# EAGLE design strobo (EAGLE 7.3.0)
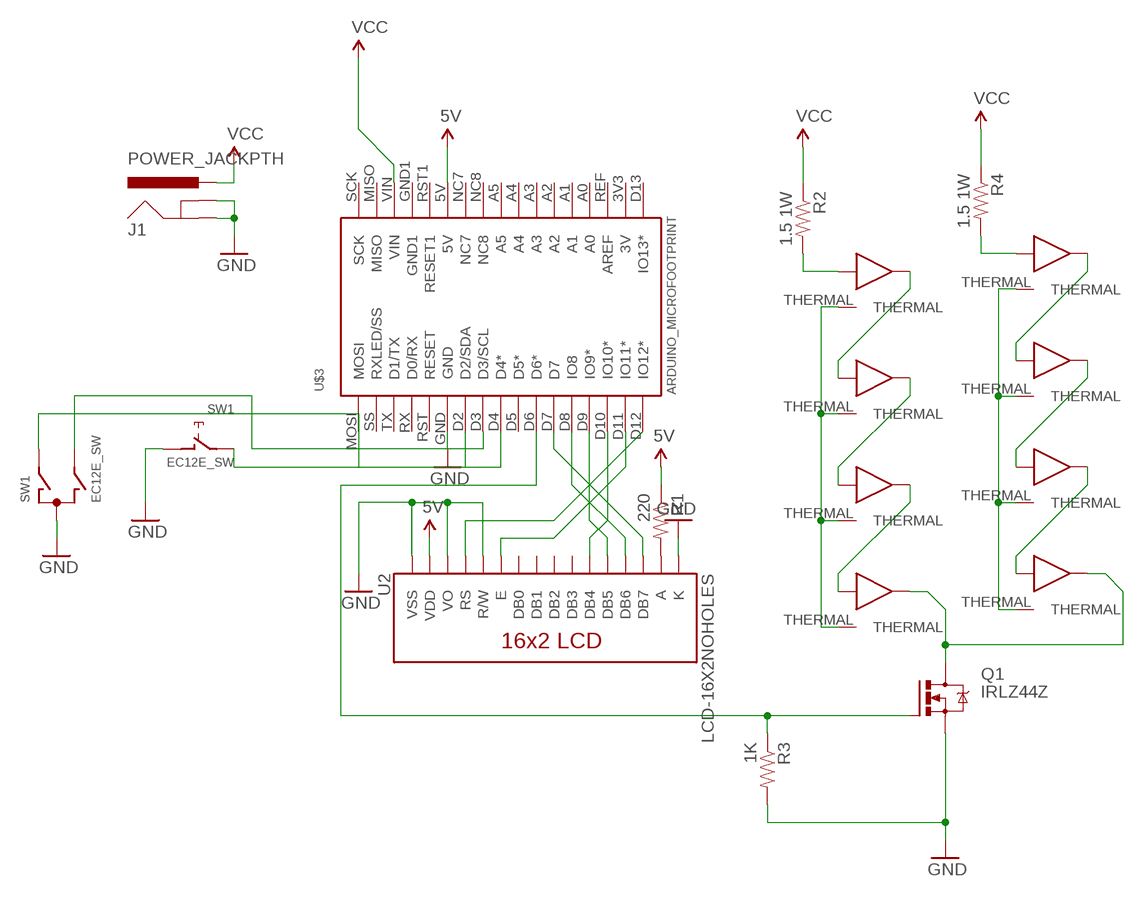
[diagram p0: schematic, sheet 1]

## Parts
J1  POWER_JACKPTH  [POWER_JACK_PTH]
Q1  IRLZ44Z  [TO220BH]
R1  220  RESISTORPTH-1/4W  [AXIAL-0.4]
R2  1.5 1W  RESISTORPTH-1/4W  [AXIAL-0.4]
R3  1K  RESISTORPTH-1/4W  [AXIAL-0.4]
R4  1.5 1W  RESISTORPTH-1/4W  [AXIAL-0.4]
SW1  EC12E_SW  [ALPS_EC12E_SW]
U2  LCD-16X2NOHOLES  [LCD-16X2_NOHOLES]
U$1  LED  [LUXEONREBEL]
U$2  LED  [LUXEONREBEL]
U$3  ARDUINO_MICROFOOTPRINT  [ARDUINO-MICRO]
U$4  LED  [LUXEONREBEL]
U$5  LED  [LUXEONREBEL]
U$6  LED  [LUXEONREBEL]
U$7  LED  [LUXEONREBEL]
U$8  LED  [LUXEONREBEL]
U$9  LED  [LUXEONREBEL]

## Nets
5V: R1.P$1 U2.2(VDD) U$3.5V
GND: J1.GND J1.GNDBREAK Q1.S R3.P$2 SW1.C SW1.D U2.1(VSS) U2.3(VO) U2.5(R/W) U2.16(K) U$3.GND
N$1: U2.14(DB7) U$3.D7
N$2: U2.13(DB6) U$3.D8(IO8)
N$3: U2.12(DB5) U$3.D9(IO9*)
N$4: U2.11(DB4) U$3.D10(IO10*)
N$5: U2.6(E) U$3.D11(IO11*)
N$6: U2.4(RS) U$3.D12(IO12*)
N$7: R2.P$2 U$1.ANODE
N$8: R1.P$2 U2.15(A)
N$10: U$4.CATHODE U$5.ANODE
N$11: U$2.CATHODE U$4.ANODE
N$12: U$1.CATHODE U$2.ANODE
N$13: Q1.G R3.P$1 U$3.D6(D6*)
N$14: SW1.E U$3.D4(D4*)
N$15: SW1.A U$3.D2(D2/SDA)
N$16: SW1.B U$3.D3(D3/SCL)
N$17: U$8.CATHODE U$9.ANODE
N$18: U$7.CATHODE U$8.ANODE
N$19: U$6.CATHODE U$7.ANODE
N$20: R4.P$2 U$6.ANODE
N$21: Q1.D U$5.CATHODE U$9.CATHODE
THERMAL1: U$1.THERMAL U$2.THERMAL U$4.THERMAL U$5.THERMAL
THERMAL2: U$6.THERMAL U$7.THERMAL U$8.THERMAL U$9.THERMAL
VCC: J1.PWR R2.P$1 R4.P$1 U$3.VIN
Unconnected: SW1.GND1(G) SW1.GND2(G) U2.7(DB0) U2.8(DB1) U2.9(DB2) U2.10(DB3) U$3.3V3(3V) U$3.A0 U$3.A1 U$3.A2 U$3.A3 U$3.A4 U$3.A5 U$3.D5(D5*) U$3.D13(IO13*) U$3.GND1 U$3.MISO U$3.MOSI U$3.NC7 U$3.NC8 U$3.REF(AREF) U$3.RST1(RESET1) U$3.RST(RESET) U$3.RX(D0/RX) U$3.SCK U$3.SS(RXLED/SS) U$3.TX(D1/TX)

## Library data of the parts
J1 = SparkFun-Connectors:POWER_JACK: Power Jack This is the standard 5.5mm barrel jack for power. The PTH is the most common, proven, reliable, footprint. The Slot footprint only works if the mill layer is transmitted to the PCB fab house so be warned. Mating wall wart : TOL-00298 (and others); PROD_ID: PRT-00119
Q1 = transistor-power:IRLZ44Z: N-Channel HEXFET® Power MOSFET Logic Level AUTOMOTIVE MOSFET Source: http://www.irf.com/product-info/datasheets/data/irlz44zpbf.pdf
R1-R4 = SparkFun-Resistors:RESISTOR: Resistor Basic schematic elements and footprints for 0603, 1206, and PTH resistors.
SW1 = switch-alps:EC12E_SW: ALPS rotary Encoder EC12E series with switch; MPN: EC12E2424407; OC_FARNELL: 1520813; OC_NEWARK: 74M1068
U2 = SparkFun-Displays:LCD-16X2: Standard text-only 16x2 parallel input LCD
U$1 U$2 U$4-U$9 = Avio:LED
U$3 = arduino-micro:ARDUINO_MICRO

## Board
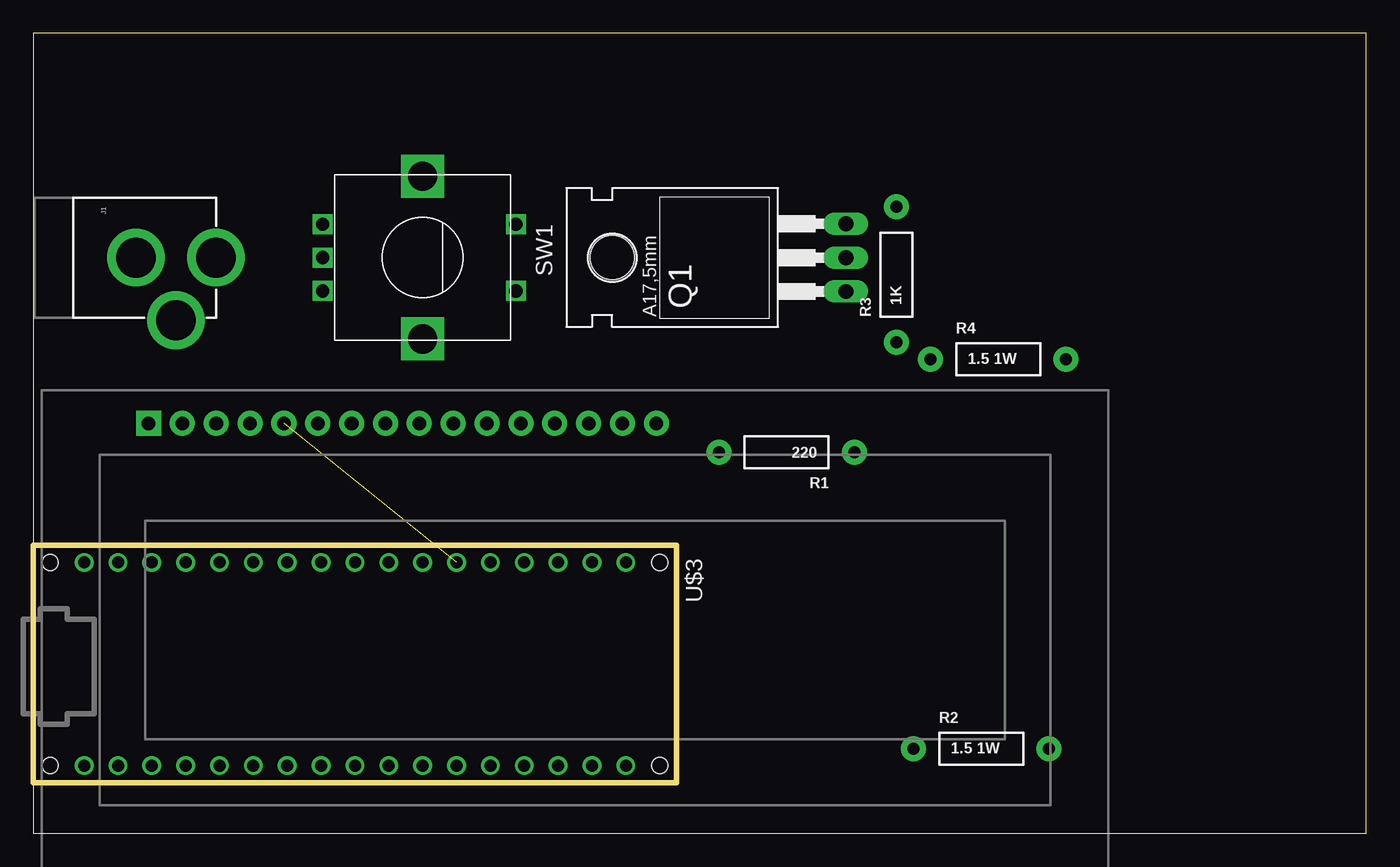
[diagram p1: board, top side]
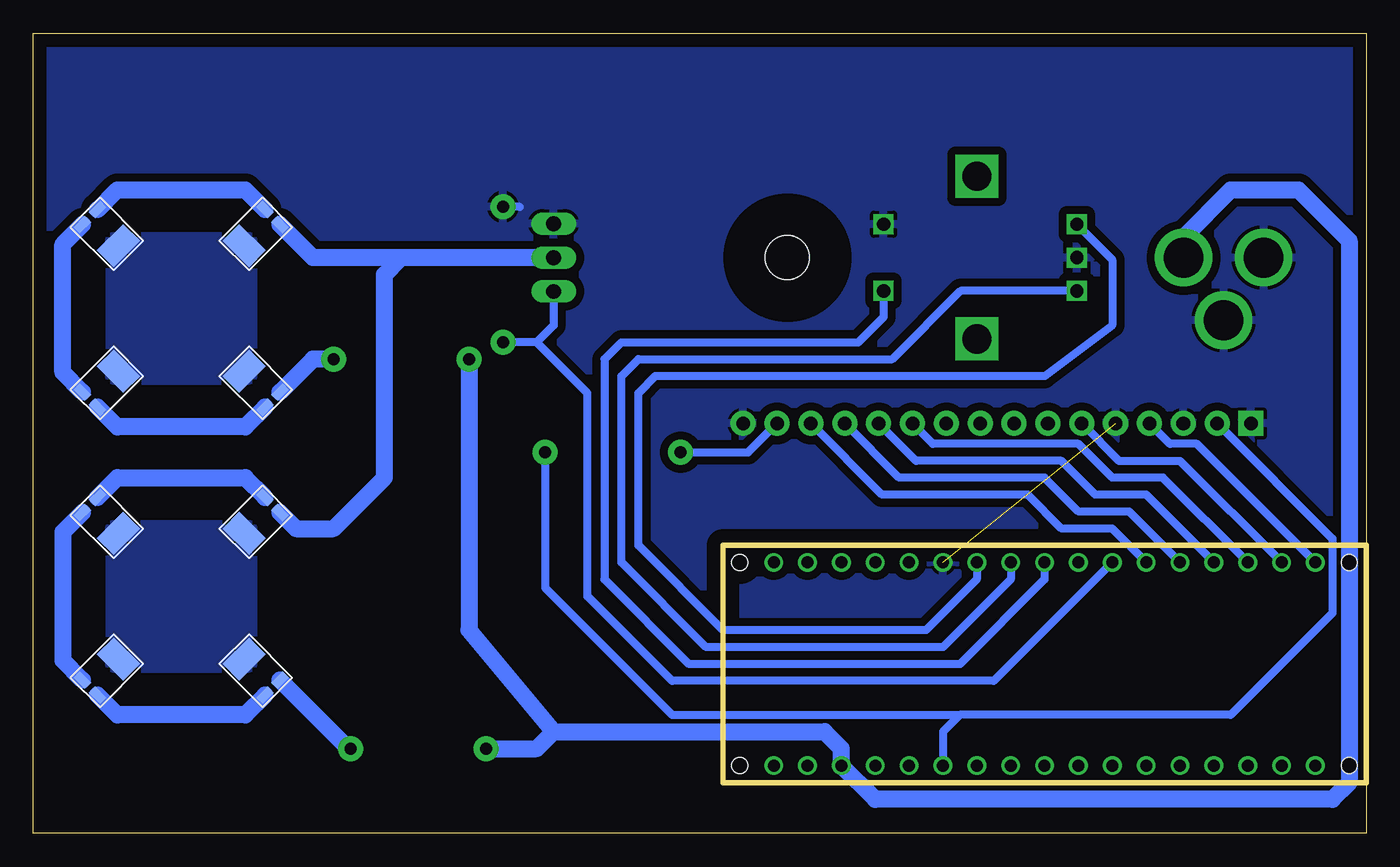
[diagram p2: board, bottom side, seen from below]

Size 100 x 60 mm. Coordinates in mm from the lower left corner, seen from the top.
Outline: 0,0 100,0 100,60 0,60 0,0
Copper layers (1*16): Top 0.035mm / dielectric 1.5mm / Bottom 0.035mm
Design rules "default": minimum track width 10mil, minimum drill 0.6mm, track to track 8mil, track to pad 8mil, pad to pad 8mil, via to via 8mil, smd to smd 8mil, copper to edge 40mil, drill to drill 8mil, minimum pad ring 10mil, minimum via ring 8mil, stop-mask expansion 4mil, vias tented up to drill 0mil, thermal gap 10mil

### Footprints (pad centres in the part's own frame; a part is rotated, then mirrored left to right if it is on the bottom)
POWER_JACK_PTH = drill 2.997 pad 4.318: GND 0,7.7; GNDBREAK 4.7,10.7; PWR 0,13.7
TO220BH = drill 1.118 long: D 0,-6.35; G -2.54,-6.35; S 2.54,-6.35 | hole 3.302: 0,11.176
AXIAL-0.4 = drill 0.9 pad 1.88: P$1 -5.08,0; P$2 5.08,0
ALPS_EC12E_SW = drill 1 square: A -2.5,-7.5; B 2.5,-7.5; C 0,-7.5; D -2.5,7; E 2.5,7 | drill 2.2 square: GND1 -6.1,0; GND2 6.1,0
LCD-16X2_NOHOLES = drill 1.016 pad 1.88 square: 1 -32,15.5 | drill 1.016 pad 1.88: 2 -29.46,15.5; 3 -26.92,15.5; 4 -24.38,15.5; 5 -21.84,15.5; 6 -19.3,15.5; 7 -16.76,15.5; 8 -14.22,15.5; 9 -11.68,15.5; 10 -9.14,15.5; 11 -6.6,15.5; 12 -4.06,15.5; 13 -1.52,15.5; 14 1.02,15.5; 15 3.56,15.5; 16 6.1,15.5
LUXEONREBEL = smd 1.2 x 0.67: ANODE 0.8,-2.5; CATHODE -0.8,-2.5 | smd 2.8 x 1.77: THERMAL 0,0.52
ARDUINO-MICRO = drill 0.9: 3V3 16.51,3.81; 5V 16.51,29.21; A0 16.51,8.89; A1 16.51,11.43; A2 16.51,13.97; A3 16.51,16.51; A4 16.51,19.05; A5 16.51,21.59; D2 1.27,26.67; D3 1.27,24.13; D4 1.27,21.59; D5 1.27,19.05; D6 1.27,16.51; D7 1.27,13.97; D8 1.27,11.43; D9 1.27,8.89; D10 1.27,6.35; D11 1.27,3.81; D12 1.27,1.27; D13 16.51,1.27; GND 1.27,29.21; GND1 16.51,34.29; MISO 16.51,39.37; MOSI 1.27,41.91; NC7 16.51,26.67; NC8 16.51,24.13; REF 16.51,6.35; RST 1.27,31.75; RST1 16.51,31.75; RX 1.27,34.29; SCK 16.51,41.91; SS 1.27,39.37; TX 1.27,36.83; VIN 16.51,36.83 | hole 1.2: 1.27,-1.27; 16.51,-1.27; 1.27,44.45; 16.51,44.45

### Placement (x,y rotation side)
J1  0,43.18 270 top
Q1  54.61,43.18 90 top
R1  56.52,28.57 180 top
R2  71.12,6.35 0 top
R3  64.77,41.91 90 top
R4  72.39,35.56 0 top
SW1  29.21,43.18 270 top
U2  40.64,15.24 0 top
U$1  83.82,12.7 45 bottom
U$2  93.98,12.7 315 bottom
U$3  2.54,21.59 270 top
U$4  93.98,22.86 225 bottom
U$5  83.82,22.86 135 bottom
U$6  83.82,34.29 45 bottom
U$7  93.98,34.29 315 bottom
U$8  93.98,44.45 225 bottom
U$9  83.82,44.45 135 bottom

### Tracks (layer width: path | path; a pad name or v marks a point on that pad's centre or on a via)
5V
  Bottom 0.61: U2.2 2.54,22.1 2.54,16.51 10.16,8.89 30.48,8.89 | 30.48,8.89 31.75,7.62 U$3.5V | 30.48,8.89 52.07,8.89 61.59,18.41 R1.P$1
GND  (1 unrouted)
  Bottom 0.61: 63.5,46.99 R3.P$2
  pour Bottom (isolate 0.61): 100,0 100,60 0,62.54 0,0
N$1
  Bottom 0.61: U2.14 36.32,25.4 25.4,25.4 22.86,22.86 19.05,22.86 U$3.D7
N$2
  Bottom 0.61: U$3.D8 17.78,24.13 21.59,24.13 24.13,26.67 35.05,26.67 U2.13
N$3
  Bottom 0.61: U$3.D9 16.51,25.4 20.32,25.4 22.86,27.94 33.78,27.94 U2.12
N$4
  Bottom 0.61: U$3.D10 15.24,26.67 19.05,26.67 21.59,29.21 32.51,29.21 U2.11
N$5
  Bottom 0.61: U2.6 18.54,27.94 13.97,27.94 U$3.D11
N$6
  Bottom 0.61: U2.4 14.73,29.21 12.7,29.21 U$3.D12
N$7
  Bottom 1.27: R2.P$2 76.34,6.35 U$1.ANODE
N$8
  Bottom 0.61: U2.15 46.37,28.57 R1.P$2
N$10
  Bottom 1.27: U$5.ANODE 84.09,26.67 93.71,26.67 U$4.CATHODE
N$11
  Bottom 1.27: U$4.ANODE 97.79,22.59 97.79,12.97 U$2.CATHODE
N$12
  Bottom 1.27: U$2.ANODE 93.71,8.89 84.09,8.89 U$1.CATHODE
N$13
  Bottom 0.61: U$3.D6 27.94,11.43 52.07,11.43 58.42,17.78 58.42,33.02 62.23,36.83 | 62.23,36.83 R3.P$1 | Q1.G 60.96,38.1 62.23,36.83
N$14
  Bottom 0.61: SW1.E 36.21,38.72 38.1,36.83 55.88,36.83 57.15,35.56 57.15,19.05 50.8,12.7 30.48,12.7 24.13,19.05 U$3.D4
N$15
  Bottom 0.61: SW1.A 19.05,43.02 19.05,38.1 24.13,34.29 53.34,34.29 54.61,33.02 54.61,21.59 48.26,15.24 33.02,15.24 29.21,19.05 U$3.D2
N$16
  Bottom 0.61: SW1.B 30.44,40.68 35.56,35.56 54.61,35.56 55.88,34.29 55.88,20.32 49.53,13.97 31.75,13.97 26.67,19.05 U$3.D3
N$17
  Bottom 1.27: U$9.ANODE 84.09,48.26 93.71,48.26 U$8.CATHODE
N$18
  Bottom 1.27: U$8.ANODE 97.79,44.18 97.79,34.56 U$7.CATHODE
N$19
  Bottom 1.27: U$7.ANODE 93.71,30.48 84.09,30.48 U$6.CATHODE
N$20
  Bottom 1.27: R4.P$2 79.01,35.56 U$6.ANODE
N$21
  Bottom 1.27: U$9.CATHODE 79.01,43.18 72.39,43.18 | Q1.D 72.39,43.18 | U$5.CATHODE 80.28,22.86 77.47,22.86 73.66,26.67 73.66,41.91 72.39,43.18
THERMAL1
  pour Bottom: 83.82,22.86 93.98,22.86 93.98,12.7 83.82,12.7
THERMAL2
  pour Bottom: 83.82,44.45 93.98,44.45 93.98,34.29 83.82,34.29
VCC
  Bottom 1.27: 60.96,7.62 40.64,7.62 39.37,6.35 U$3.VIN 36.83,2.54 2.54,2.54 1.27,3.81 1.27,44.45 5.08,48.26 10.16,48.26 13.7,44.72 J1.PWR | R4.P$1 67.31,15.24 60.96,7.62 | R2.P$1 62.23,6.35 60.96,7.62